# Altium project Receiver.PrjPcb (part 3 of 3)

## Sheet ADC.SchDoc: ADC
size A2; DrawnBy: Patrik Staudenmayer; DocumentNumber: 10; SheetNumber: 10; SheetTotal: 15
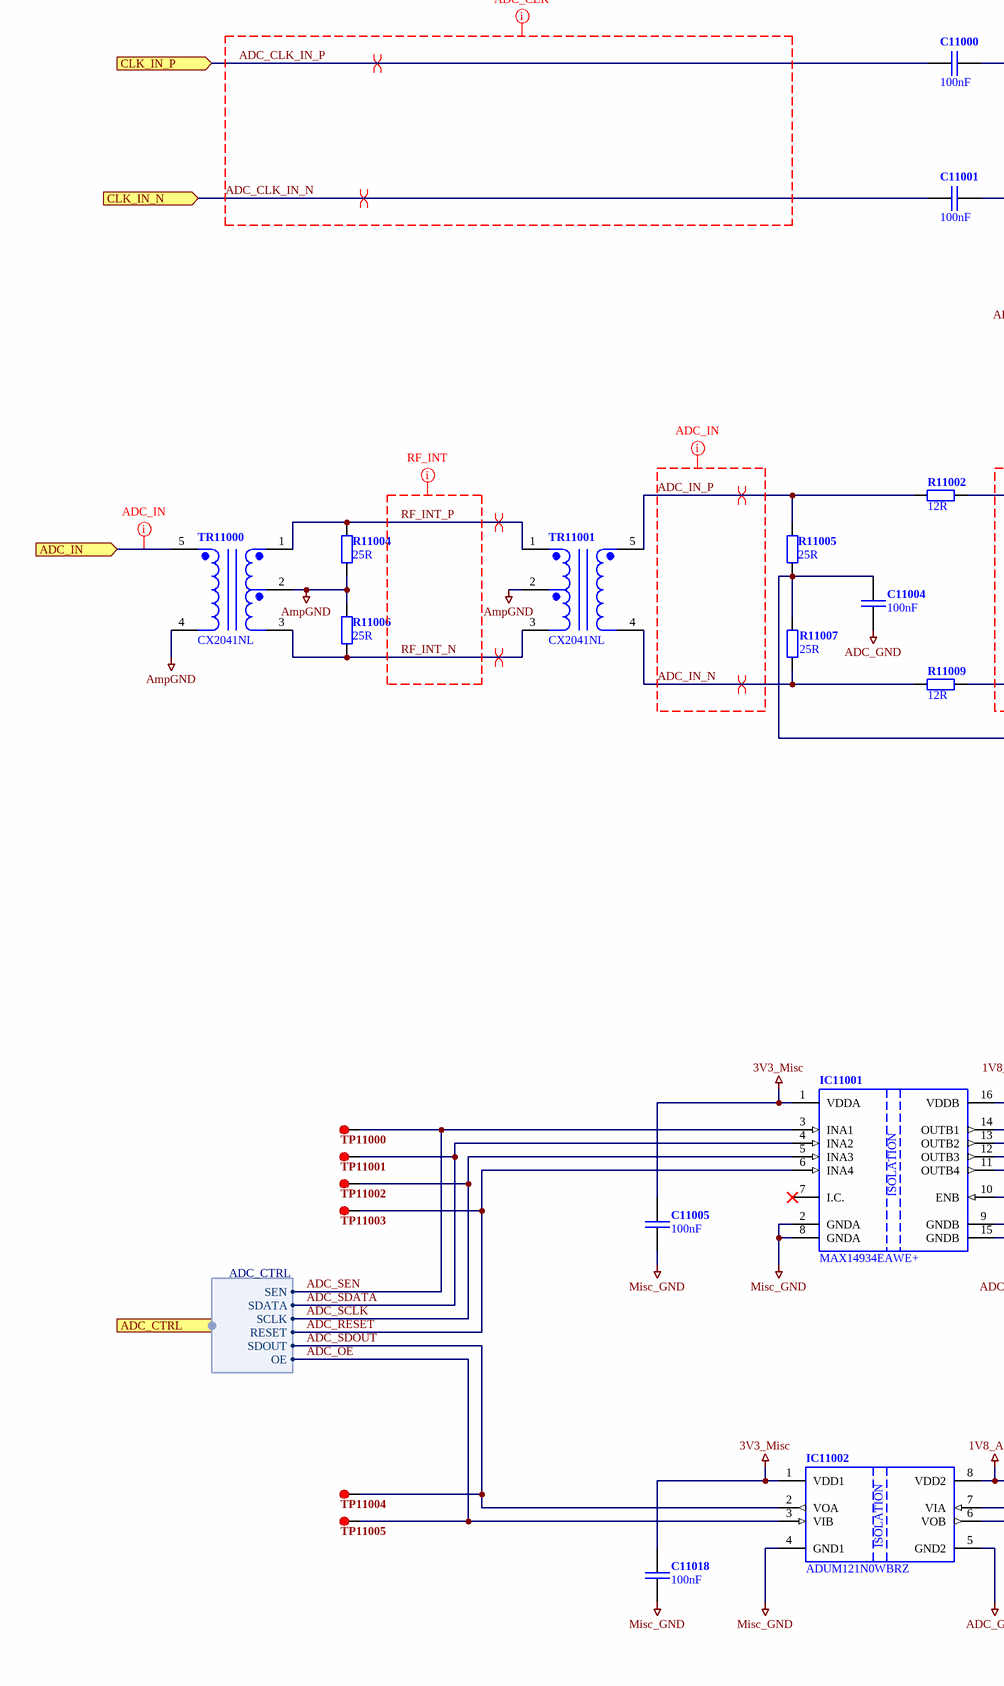
[diagram p14: ADC.SchDoc, left]
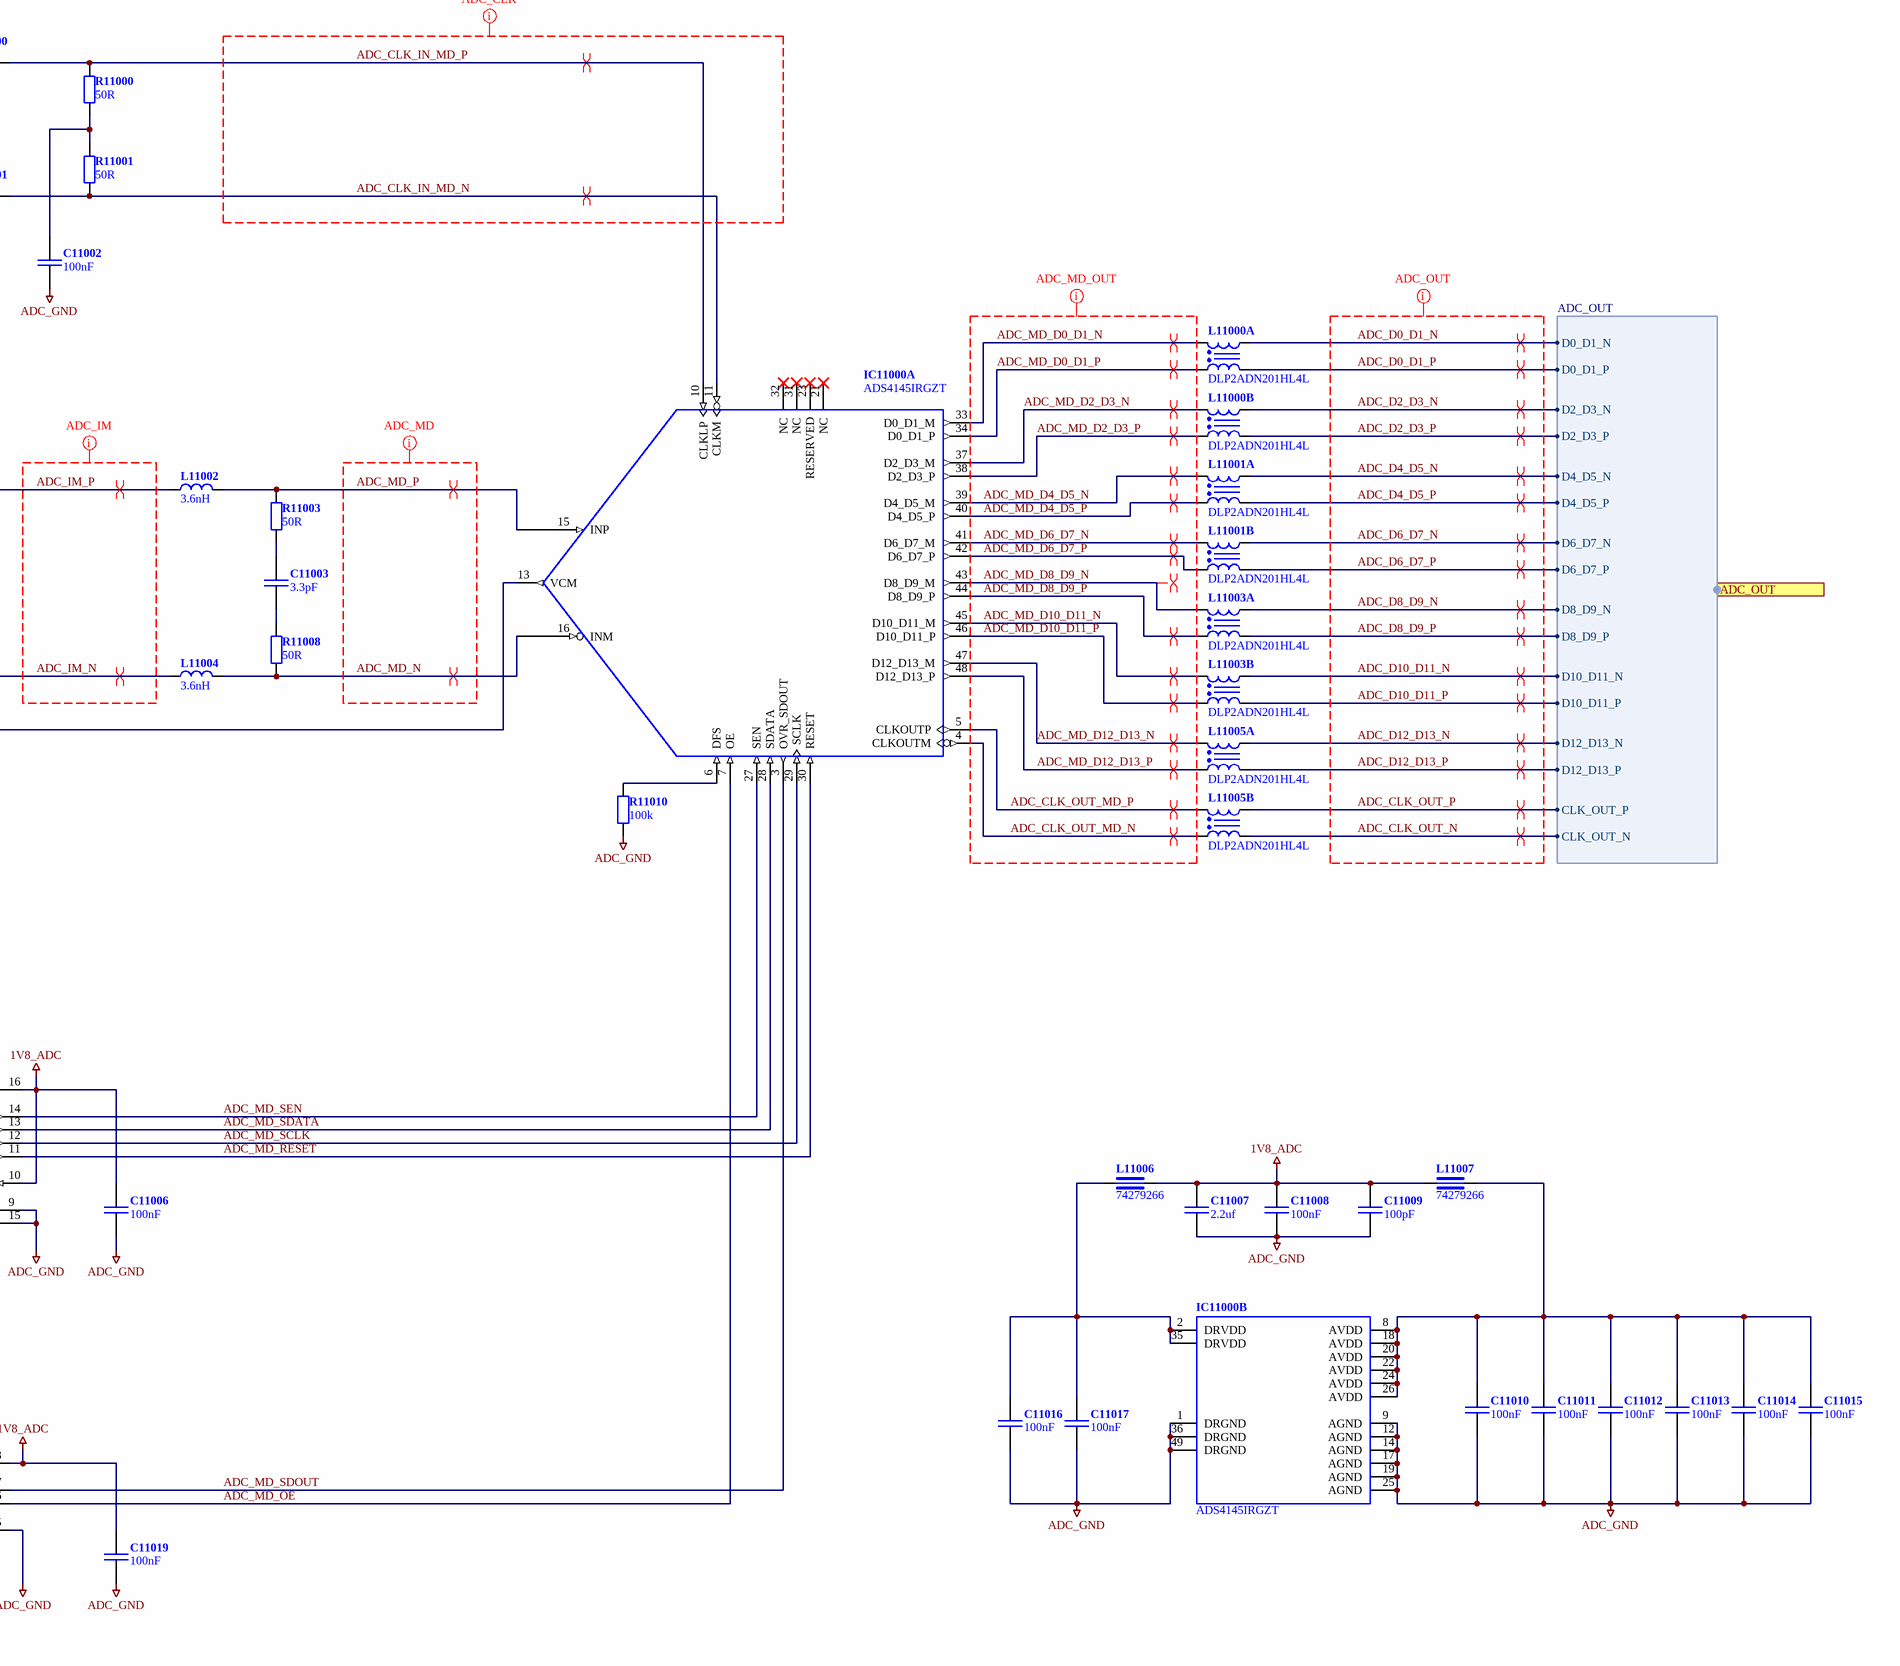
[diagram p15: ADC.SchDoc, right]

### Parts
C11000  100nF  [C_0603_N [CAPC1608N IPC]]
C11001  100nF  [C_0603_N [CAPC1608N IPC]]
C11002  100nF  [C_0603_N [CAPC1608N IPC]]
C11003  3.3pF  [C_0603_N [CAPC1608N IPC]]
C11004  100nF  [C_0603_N [CAPC1608N IPC]]
C11005  100nF  [C_0603_N [CAPC1608N IPC]]
C11006  100nF  [C_0603_N [CAPC1608N IPC]]
C11007  2.2uf  [C_1206_N [CAPC3216N IPC]]
C11008  100nF  [C_0805_N [CAPC2013N IPC]]
C11009  100pF  [C_0603_N [CAPC1608N IPC]]
C11010  100nF  [C_0603_N [CAPC1608N IPC]]
C11011  100nF  [C_0603_N [CAPC1608N IPC]]
C11012  100nF  [C_0603_N [CAPC1608N IPC]]
C11013  100nF  [C_0603_N [CAPC1608N IPC]]
C11014  100nF  [C_0603_N [CAPC1608N IPC]]
C11015  100nF  [C_0603_N [CAPC1608N IPC]]
C11016  100nF  [C_0603_N [CAPC1608N IPC]]
C11017  100nF  [C_0603_N [CAPC1608N IPC]]
C11018  100nF  [C_0603_N [CAPC1608N IPC]]
C11019  100nF  [C_0603_N [CAPC1608N IPC]]
IC11000  ADS4145IRGZT  [QFN50P700X700X100_HS-49N]  (parts A,B of 2)
IC11001  MAX14934EAWE+  [SOIC127P1030X265-16N IPC]
IC11002  ADUM121N0WBRZ  [SOIC127P600X175-8N IPC]
L11000  DLP2ADN201HL4L  [CAF-50P200X100-8N]  (parts A,B of 2)
L11001  DLP2ADN201HL4L  [CAF-50P200X100-8N]  (parts A,B of 2)
L11002  3.6nH  [L_0603_N [INDC1608N IPC]]
L11003  DLP2ADN201HL4L  [CAF-50P200X100-8N]  (parts A,B of 2)
L11004  3.6nH  [L_0603_N [INDC1608N IPC]]
L11005  DLP2ADN201HL4L  [CAF-50P200X100-8N]  (parts A,B of 2)
L11006  74279266  [L_0603_N [INDC1608N IPC]]
L11007  74279266  [L_0603_N [INDC1608N IPC]]
R11000  50R  [R_0603_N [RESC1608N IPC]]
R11001  50R  [R_0603_N [RESC1608N IPC]]
R11002  12R  [R_0603_N [RESC1608N IPC]]
R11003  50R  [R_0603_N [RESC1608N IPC]]
R11004  25R  [R_0603_N [RESC1608N IPC]]
R11005  25R  [R_0603_N [RESC1608N IPC]]
R11006  25R  [R_0603_N [RESC1608N IPC]]
R11007  25R  [R_0603_N [RESC1608N IPC]]
R11008  50R  [R_0603_N [RESC1608N IPC]]
R11009  12R  [R_0603_N [RESC1608N IPC]]
R11010  100k  [R_0603_N [RESC1608N IPC]]
TP11000  TP_GENERIC  [TP_0.8_P100T]  (value not drawn)  (no BOM)
TP11001  TP_GENERIC  [TP_0.8_P100T]  (value not drawn)  (no BOM)
TP11002  TP_GENERIC  [TP_0.8_P100T]  (value not drawn)  (no BOM)
TP11003  TP_GENERIC  [TP_0.8_P100T]  (value not drawn)  (no BOM)
TP11004  TP_GENERIC  [TP_0.8_P100T]  (value not drawn)  (no BOM)
TP11005  TP_GENERIC  [TP_0.8_P100T]  (value not drawn)  (no BOM)
TR11000  CX2041NL  [TR_CX2041NL]
TR11001  CX2041NL  [TR_CX2041NL]

### Ports
ADC_CTRL (out, harness ADC_CTRL), ADC_IN (in), ADC_OUT (out, harness ADC_OUT), CLK_IN_N (in), CLK_IN_P (in)

### Harnesses
ADC_CTRL: SEN, SDATA, SCLK, RESET, SDOUT, OE
ADC_OUT: D0_D1_N, D0_D1_P, D2_D3_N, D2_D3_P, D4_D5_N, D4_D5_P, D6_D7_N, D6_D7_P, D8_D9_N, D8_D9_P, D10_D11_N, D10_D11_P, D12_D13_N, D12_D13_P, CLK_OUT_P, CLK_OUT_N

### Nets
1V8_ADC: C11006.1 C11007.1 C11008.1 C11009.1 C11019.1 IC11001.10(ENB) IC11001.16(VDDB) IC11002.8(VDD2) L11006.2 L11007.2
3V3_Misc: C11005.2 C11018.2 IC11001.1(VDDA) IC11002.1(VDD1)
ADC_GND: C11002.2 C11004.2 C11006.2 C11007.2 C11008.2 C11009.2 C11010.2 C11011.2 C11012.2 C11013.2 C11014.2 C11015.2 C11016.2 C11017.2 C11019.2 IC11000.1(DRGND) IC11000.9(AGND) IC11000.12(AGND) IC11000.14(AGND) IC11000.17(AGND) IC11000.19(AGND) IC11000.25(AGND) IC11000.36(DRGND) IC11000.49(DRGND) IC11001.9(GNDB) IC11001.15(GNDB) IC11002.5(GND2) R11010.1
AmpGND: R11004.1 R11006.2 TR11000.2 TR11000.4 TR11001.2
Misc_GND: C11005.1 C11018.1 IC11001.2(GNDA) IC11001.8(GNDA) IC11002.4(GND1)  [project net Con_GND]
ADC_CLK_IN_MD_N: C11001.1 IC11000.11(CLKM) R11001.1
ADC_CLK_IN_MD_P: C11000.1 IC11000.10(CLKLP) R11000.2
ADC_CLK_IN_N: C11001.2 ; port CLK_IN_N
ADC_CLK_IN_P: C11000.2 ; port CLK_IN_P
ADC_CLK_OUT_MD_N: IC11000.4(CLKOUTM) L11005.3
ADC_CLK_OUT_MD_P: IC11000.5(CLKOUTP) L11005.4
ADC_CLK_OUT_N: L11005.6 ; port ADC_OUT.CLK_OUT_N
ADC_CLK_OUT_P: L11005.5 ; port ADC_OUT.CLK_OUT_P
ADC_D0_D1_N: L11000.7 ; port ADC_OUT.D0_D1_N
ADC_D0_D1_P: L11000.8 ; port ADC_OUT.D0_D1_P
ADC_D2_D3_N: L11000.5 ; port ADC_OUT.D2_D3_N
ADC_D2_D3_P: L11000.6 ; port ADC_OUT.D2_D3_P
ADC_D4_D5_N: L11001.7 ; port ADC_OUT.D4_D5_N
ADC_D4_D5_P: L11001.8 ; port ADC_OUT.D4_D5_P
ADC_D6_D7_N: L11001.5 ; port ADC_OUT.D6_D7_N
ADC_D6_D7_P: L11001.6 ; port ADC_OUT.D6_D7_P
ADC_D8_D9_N: L11003.7 ; port ADC_OUT.D8_D9_N
ADC_D8_D9_P: L11003.8 ; port ADC_OUT.D8_D9_P
ADC_D10_D11_N: L11003.5 ; port ADC_OUT.D10_D11_N
ADC_D10_D11_P: L11003.6 ; port ADC_OUT.D10_D11_P
ADC_D12_D13_N: L11005.7 ; port ADC_OUT.D12_D13_N
ADC_D12_D13_P: L11005.8 ; port ADC_OUT.D12_D13_P
ADC_IM_N: L11004.1 R11009.1
ADC_IM_P: L11002.1 R11002.1
ADC_IN_N: R11007.1 R11009.2 TR11001.4
ADC_IN_P: R11002.2 R11005.2 TR11001.5
ADC_MD_D0_D1_N: IC11000.33(D0_D1_M) L11000.2
ADC_MD_D0_D1_P: IC11000.34(D0_D1_P) L11000.1
ADC_MD_D2_D3_N: IC11000.37(D2_D3_M) L11000.4
ADC_MD_D2_D3_P: IC11000.38(D2_D3_P) L11000.3
ADC_MD_D4_D5_N: IC11000.39(D4_D5_M) L11001.2
ADC_MD_D4_D5_P: IC11000.40(D4_D5_P) L11001.1
ADC_MD_D6_D7_N: IC11000.41(D6_D7_M) L11001.4
ADC_MD_D6_D7_P: IC11000.42(D6_D7_P) L11001.3
ADC_MD_D8_D9_N: IC11000.43(D8_D9_M) L11003.2
ADC_MD_D8_D9_P: IC11000.44(D8_D9_P) L11003.1
ADC_MD_D10_D11_N: IC11000.45(D10_D11_M) L11003.4
ADC_MD_D10_D11_P: IC11000.46(D10_D11_P) L11003.3
ADC_MD_D12_D13_N: IC11000.47(D12_D13_M) L11005.2
ADC_MD_D12_D13_P: IC11000.48(D12_D13_P) L11005.1
ADC_MD_N: IC11000.16(INM) L11004.2 R11008.1
ADC_MD_OE: IC11000.7(OE) IC11002.6(VOB)
ADC_MD_P: IC11000.15(INP) L11002.2 R11003.2
ADC_MD_RESET: IC11000.30(RESET) IC11001.11(OUTB4)
ADC_MD_SCLK: IC11000.29(SCLK) IC11001.12(OUTB3)
ADC_MD_SDATA: IC11000.28(SDATA) IC11001.13(OUTB2)
ADC_MD_SDOUT: IC11000.3(OVR_SDOUT) IC11002.7(VIA)
ADC_MD_SEN: IC11000.27(SEN) IC11001.14(OUTB1)
ADC_OE: IC11002.3(VIB) TP11005.1 ; port ADC_CTRL.OE
ADC_RESET: IC11001.6(INA4) TP11003.1 ; port ADC_CTRL.RESET
ADC_SCLK: IC11001.5(INA3) TP11002.1 ; port ADC_CTRL.SCLK
ADC_SDATA: IC11001.4(INA2) TP11001.1 ; port ADC_CTRL.SDATA
ADC_SDOUT: IC11002.2(VOA) TP11004.1 ; port ADC_CTRL.SDOUT
ADC_SEN: IC11001.3(INA1) TP11000.1 ; port ADC_CTRL.SEN
RF_INT_N: R11006.1 TR11000.3 TR11001.3
RF_INT_P: R11004.2 TR11000.1 TR11001.1
NetC11002_1: C11002.1 R11000.1 R11001.2
NetC11003_1: C11003.1 R11003.1
NetC11003_2: C11003.2 R11008.2
NetC11004_1: C11004.1 IC11000.13(VCM) R11005.1 R11007.2
NetC11010_1: C11010.1 C11011.1 C11012.1 C11013.1 C11014.1 C11015.1 IC11000.8(AVDD) IC11000.18(AVDD) IC11000.20(AVDD) IC11000.22(AVDD) IC11000.24(AVDD) IC11000.26(AVDD) L11007.1
NetC11016_1: C11016.1 C11017.1 IC11000.2(DRVDD) IC11000.35(DRVDD) L11006.1
NetIC11000_6: IC11000.6(DFS) R11010.2
NetTR11000_5: TR11000.5 ; port ADC_IN

Not connected (* = marked no-connect by the designer): IC11000 21(NC)* 23(RESERVED)* 31(NC)* 32(NC)*; IC11001 7(I.C.)*

### Layout directives
differential pair: ADC_CLK_IN_MD_N, ADC_CLK_IN_MD_P, ADC_CLK_IN_N, ADC_CLK_IN_P, ADC_CLK_OUT_MD_N, ADC_CLK_OUT_MD_P, ADC_CLK_OUT_N, ADC_CLK_OUT_P, ADC_D0_D1_N, ADC_D0_D1_P, ADC_D2_D3_N, ADC_D2_D3_P, ADC_D4_D5_N, ADC_D4_D5_P, ADC_D6_D7_N, ADC_D6_D7_P, ADC_D8_D9_N, ADC_D8_D9_P, ADC_D10_D11_N, ADC_D10_D11_P, ADC_D12_D13_N, ADC_D12_D13_P, ADC_IM_N, ADC_IM_P, ADC_IN_N, ADC_IN_P, ADC_MD_D0_D1_N, ADC_MD_D0_D1_P, ADC_MD_D2_D3_N, ADC_MD_D2_D3_P, ADC_MD_D4_D5_N, ADC_MD_D4_D5_P, ADC_MD_D6_D7_N, ADC_MD_D6_D7_P, ADC_MD_D8_D9_N, ADC_MD_D8_D9_P, ADC_MD_D10_D11_N, ADC_MD_D10_D11_P, ADC_MD_D12_D13_N, ADC_MD_D12_D13_P, ADC_MD_N, ADC_MD_P, RF_INT_N, RF_INT_P
net class ADC_IN; rule Differential Pairs Routing [Pref Gap = 5mil    Min Gap  = 5mil    Max Gap  = 5milPref Width = 16.899mil    Min Width  = 14.432mil    Max Width  = 16.899mil]: ADC_IN_N, ADC_IN_P
net class ADC_IM; rule Differential Pairs Routing [Pref Gap = 5mil    Min Gap  = 5mil    Max Gap  = 5milPref Width = 16.899mil    Min Width  = 14.432mil    Max Width  = 16.899mil]: ADC_IM_N, ADC_IM_P
net class ADC_MD; rule Differential Pairs Routing [Pref Gap = 5mil    Min Gap  = 5mil    Max Gap  = 5milPref Width = 16.899mil    Min Width  = 14.432mil    Max Width  = 16.899mil]: ADC_MD_N, ADC_MD_P
net class AD_IM; rule Differential Pairs Routing [Pref Gap = 5mil    Min Gap  = 5mil    Max Gap  = 5milPref Width = 4.138mil    Min Width  = 2.925mil    Max Width  = 4.138mil]; rule Maximum Via Count Constraint [Max Count = 2]; rule Matched Net Lengths [Tolerance = 25mil]: ADC_CLK_IN_N, ADC_CLK_IN_P
rule Maximum Via Count Constraint [Max Count = 2]; rule Differential Pairs Routing [Pref Gap = 5mil    Min Gap  = 5mil    Max Gap  = 5milPref Width = 4.138mil    Min Width  = 2.925mil    Max Width  = 4.138mil]; rule Matched Net Lengths [Tolerance = 25mil]; net class ADC_MD_OUT: ADC_CLK_OUT_MD_N, ADC_CLK_OUT_MD_P, ADC_MD_D0_D1_N, ADC_MD_D0_D1_P, ADC_MD_D2_D3_N, ADC_MD_D2_D3_P, ADC_MD_D4_D5_N, ADC_MD_D4_D5_P, ADC_MD_D6_D7_N, ADC_MD_D6_D7_P, ADC_MD_D8_D9_N, ADC_MD_D8_D9_P, ADC_MD_D10_D11_N, ADC_MD_D10_D11_P, ADC_MD_D12_D13_N, ADC_MD_D12_D13_P
rule Maximum Via Count Constraint [Max Count = 2]; rule Differential Pairs Routing [Pref Gap = 5mil    Min Gap  = 5mil    Max Gap  = 5milPref Width = 4.138mil    Min Width  = 2.925mil    Max Width  = 4.138mil]; rule Matched Net Lengths [Tolerance = 25mil]; net class ADC_OUT: ADC_CLK_OUT_N, ADC_CLK_OUT_P, ADC_D0_D1_N, ADC_D0_D1_P, ADC_D2_D3_N, ADC_D2_D3_P, ADC_D4_D5_N, ADC_D4_D5_P, ADC_D6_D7_N, ADC_D6_D7_P, ADC_D8_D9_N, ADC_D8_D9_P, ADC_D10_D11_N, ADC_D10_D11_P, ADC_D12_D13_N, ADC_D12_D13_P
rule Differential Pairs Routing [Pref Gap = 5mil    Min Gap  = 5mil    Max Gap  = 5milPref Width = 16.899mil    Min Width  = 14.432mil    Max Width  = 16.899mil]; rule Maximum Via Count Constraint [Max Count = 2]; rule Matched Net Lengths [Tolerance = 25mil]; net class RF_INT: RF_INT_N, RF_INT_P
rule Width Constraint [Pref Impedance = 50.00ohms    Min Impedance = 50.00ohms    Max Impedance = 50.00ohms]: NetTR11000_5
net class ADC_MD; rule Differential Pairs Routing [Pref Gap = 5mil    Min Gap  = 5mil    Max Gap  = 5milPref Width = 4.138mil    Min Width  = 2.925mil    Max Width  = 4.138mil]; rule Maximum Via Count Constraint [Max Count = 2]; rule Matched Net Lengths [Tolerance = 25mil]: ADC_CLK_IN_MD_N, ADC_CLK_IN_MD_P

### Notes on the sheet
- Project:
- Title:
- Size:
- Date:
- File:
- A2
- Project ID:
- Time:
- Sheet
- Version:
- of
- Variant:
- (in symbol IC_ADUM121N0WBRZ) ISOLATION
- (in symbol IC_MAX14934EAWE+) ISOLATION

### Library data of the parts
C11000-C11002 = C_GENERIC: Prometheus_Manufacturer: Yageo; Prometheus_ID: CC0603JRX7R7BB104; Prometheus_ManPartNo: 100nF; Prometheus_Comment: 100nF; Prometheus_CurrentFootprint: C_0603_N [CAPC1608N IPC]
C11003-C11019 = C_GENERIC: Prometheus_ID: *; Prometheus_Manufacturer: *
  C11003: Prometheus_ManPartNo: 3.3pF; Prometheus_Comment: 3.3pF; Prometheus_CurrentFootprint: C_0603_N [CAPC1608N IPC]
  C11004-C11006 C11010-C11019: Prometheus_ManPartNo: 100nF; Prometheus_Comment: 100nF; Prometheus_CurrentFootprint: C_0603_N [CAPC1608N IPC]
  C11007: Prometheus_ManPartNo: 2.2uf; Prometheus_Comment: 2.2uf; Prometheus_CurrentFootprint: C_1206_N [CAPC3216N IPC]
  C11008: Prometheus_ManPartNo: 100nF; Prometheus_Comment: 100nF; Prometheus_CurrentFootprint: C_0805_N [CAPC2013N IPC]
  C11009: Prometheus_ManPartNo: 100pF; Prometheus_Comment: 100pF; Prometheus_CurrentFootprint: C_0603_N [CAPC1608N IPC]
IC11000 = IC_ADS4145IRGZT: 12 Bit, 125 MSPS Ultra-Low-Power ADC / Dynamical Power Scaling with sample rate / Output Interface: / DDR LVDS / Parallel CMOS / 1.8 V Single supply; Prometheus_Manufacturer: Texas Instruments; Prometheus_ManPartNo: ADS4145IRGZT; Prometheus_Comment: ADS4145IRGZT; Prometheus_CurrentFootprint: QFN50P700X700X100_HS-49N; DatasheetURL: https://www.ti.com/lit/ds/symlink/ads4145.pdf
IC11001 = IC_MAX14934EAWE+: High-Speed, Robust-EMC Reinforced Six-Channel Digital Isolators / 100 Mbps data rate / Vcc: 2.25 V ... 5.5 V / 2.25 V to 5.5 V level translation; Prometheus_Manufacturer: Maxim Integrated; Prometheus_ManPartNo: MAX14934EAWE+; Prometheus_Comment: MAX14934EAWE+; Prometheus_CurrentFootprint: SOIC127P1030X265-16N IPC; DatasheetURL: https://datasheets.maximintegrated.com/en/ds/MAX14934-MAX14936.pdf
IC11002 = IC_ADUM121N0WBRZ: 1/1 digital isolator / 1.8 V to 5 V Level translation; Prometheus_Manufacturer: Analog Devices; Prometheus_ManPartNo: ADUM121N0WBRZ; Prometheus_Comment: ADUM121N0WBRZ; Prometheus_CurrentFootprint: SOIC127P600X175-8N IPC; DatasheetURL: https://www.analog.com/media/en/technical-documentation/data-sheets/ADuM120N_121N.pdf
L11000 L11001 L11003 L11005 = L_COMMONMODE_CHOKE_DLP2ADN201HL4L: Prometheus_Manufacturer: Murata Electronics; Prometheus_ID: *; Prometheus_ManPartNo: DLP2ADN201HL4L; Prometheus_Comment: DLP2ADN201HL4L; Prometheus_CurrentFootprint: CAF-50P200X100-8N
L11002 L11004 = L_GENERIC: Prometheus_ManPartNo: 744917036; Prometheus_Manufacturer: Wuerth Electronics; Prometheus_ID: *; Prometheus_Comment: 3.6nH; Prometheus_CurrentFootprint: L_0603_N [INDC1608N IPC]
L11006 L11007 = FB_GENERIC: 1 kOHM @ 100 MHz / 200 mA max.; Prometheus_ID: *; Prometheus_ManPartNo: 74279266; Prometheus_Manufacturer: *; Prometheus_Comment: 74279266; Prometheus_CurrentFootprint: L_0603_N [INDC1608N IPC]
R11000-R11010 = R_GENERIC_DIN: Prometheus_ID: *; Prometheus_Manufacturer: *; Prometheus_CurrentFootprint: R_0603_N [RESC1608N IPC]
  R11000 R11001 R11003 R11008: Prometheus_ManPartNo: 50R; Prometheus_Comment: 50R
  R11002 R11009: Prometheus_ManPartNo: 12R; Prometheus_Comment: 12R
  R11004-R11007: Prometheus_ManPartNo: 25R; Prometheus_Comment: 25R
  R11010: Prometheus_ManPartNo: 100k; Prometheus_Comment: 100k
TP11000-TP11005 = TP_GENERIC: Needle Test Point; Prometheus_ID: *; Prometheus_ManPartNo: TP_GENERIC; Prometheus_Manufacturer: *; Prometheus_Comment: TP_GENERIC; Prometheus_CurrentFootprint: TP_0.8_P100T
TR11000 TR11001 = TR_CX2041NL: Balun / 1:1 with center tap / 3 dB Bandwidth: 0.05 MHz to 450 MHz; Prometheus_Manufacturer: Pulse Engineering; Prometheus_ID: *; Prometheus_ManPartNo: CX2041NL; Prometheus_Comment: CX2041NL; Prometheus_CurrentFootprint: TR_CX2041NL

## Sheet ClockGenerator.SchDoc: Clock Generator
size A2; DrawnBy: Patrik Staudenmayer; DocumentNumber: 11; SheetNumber: 11; SheetTotal: 15
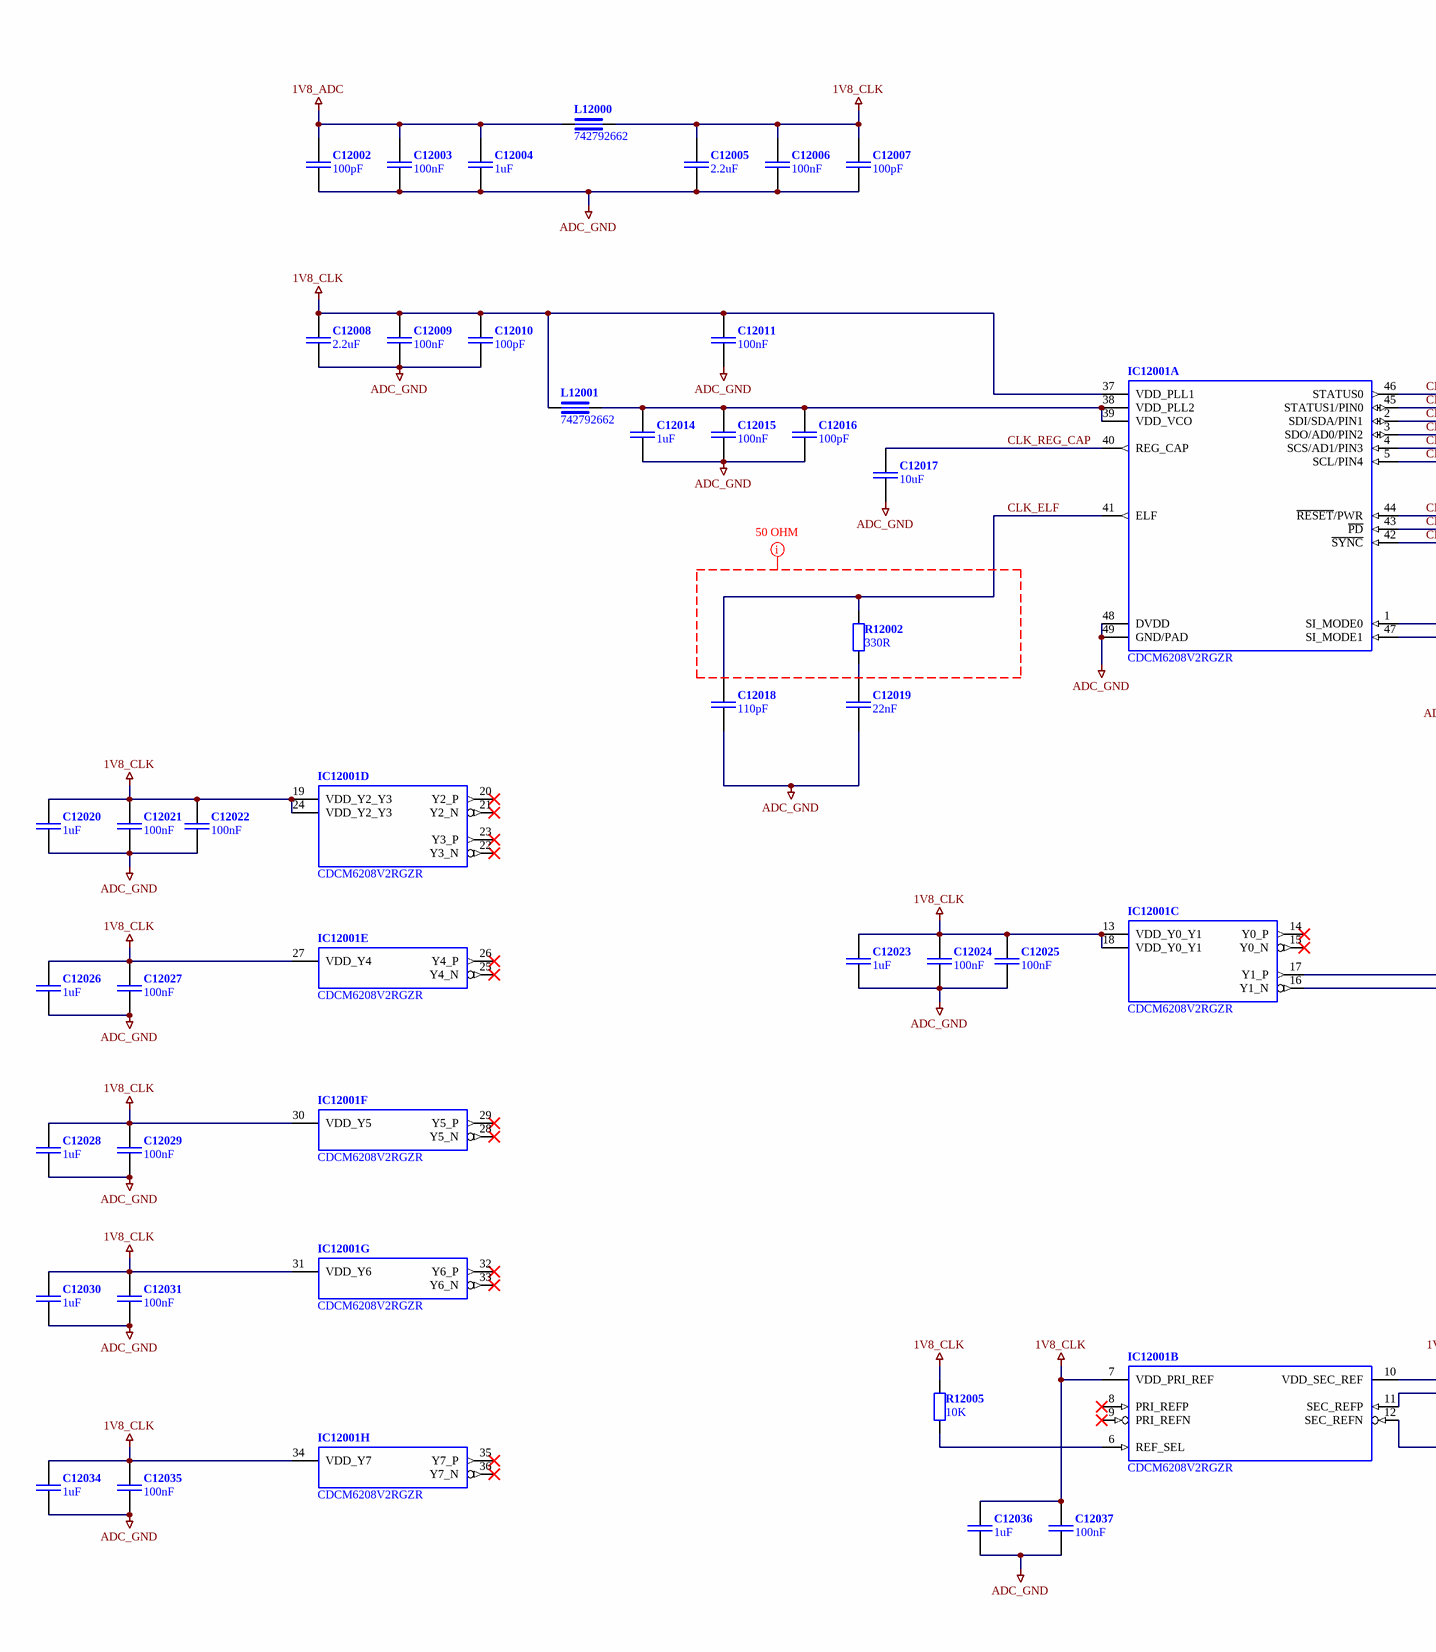
[diagram p16: ClockGenerator.SchDoc, left]
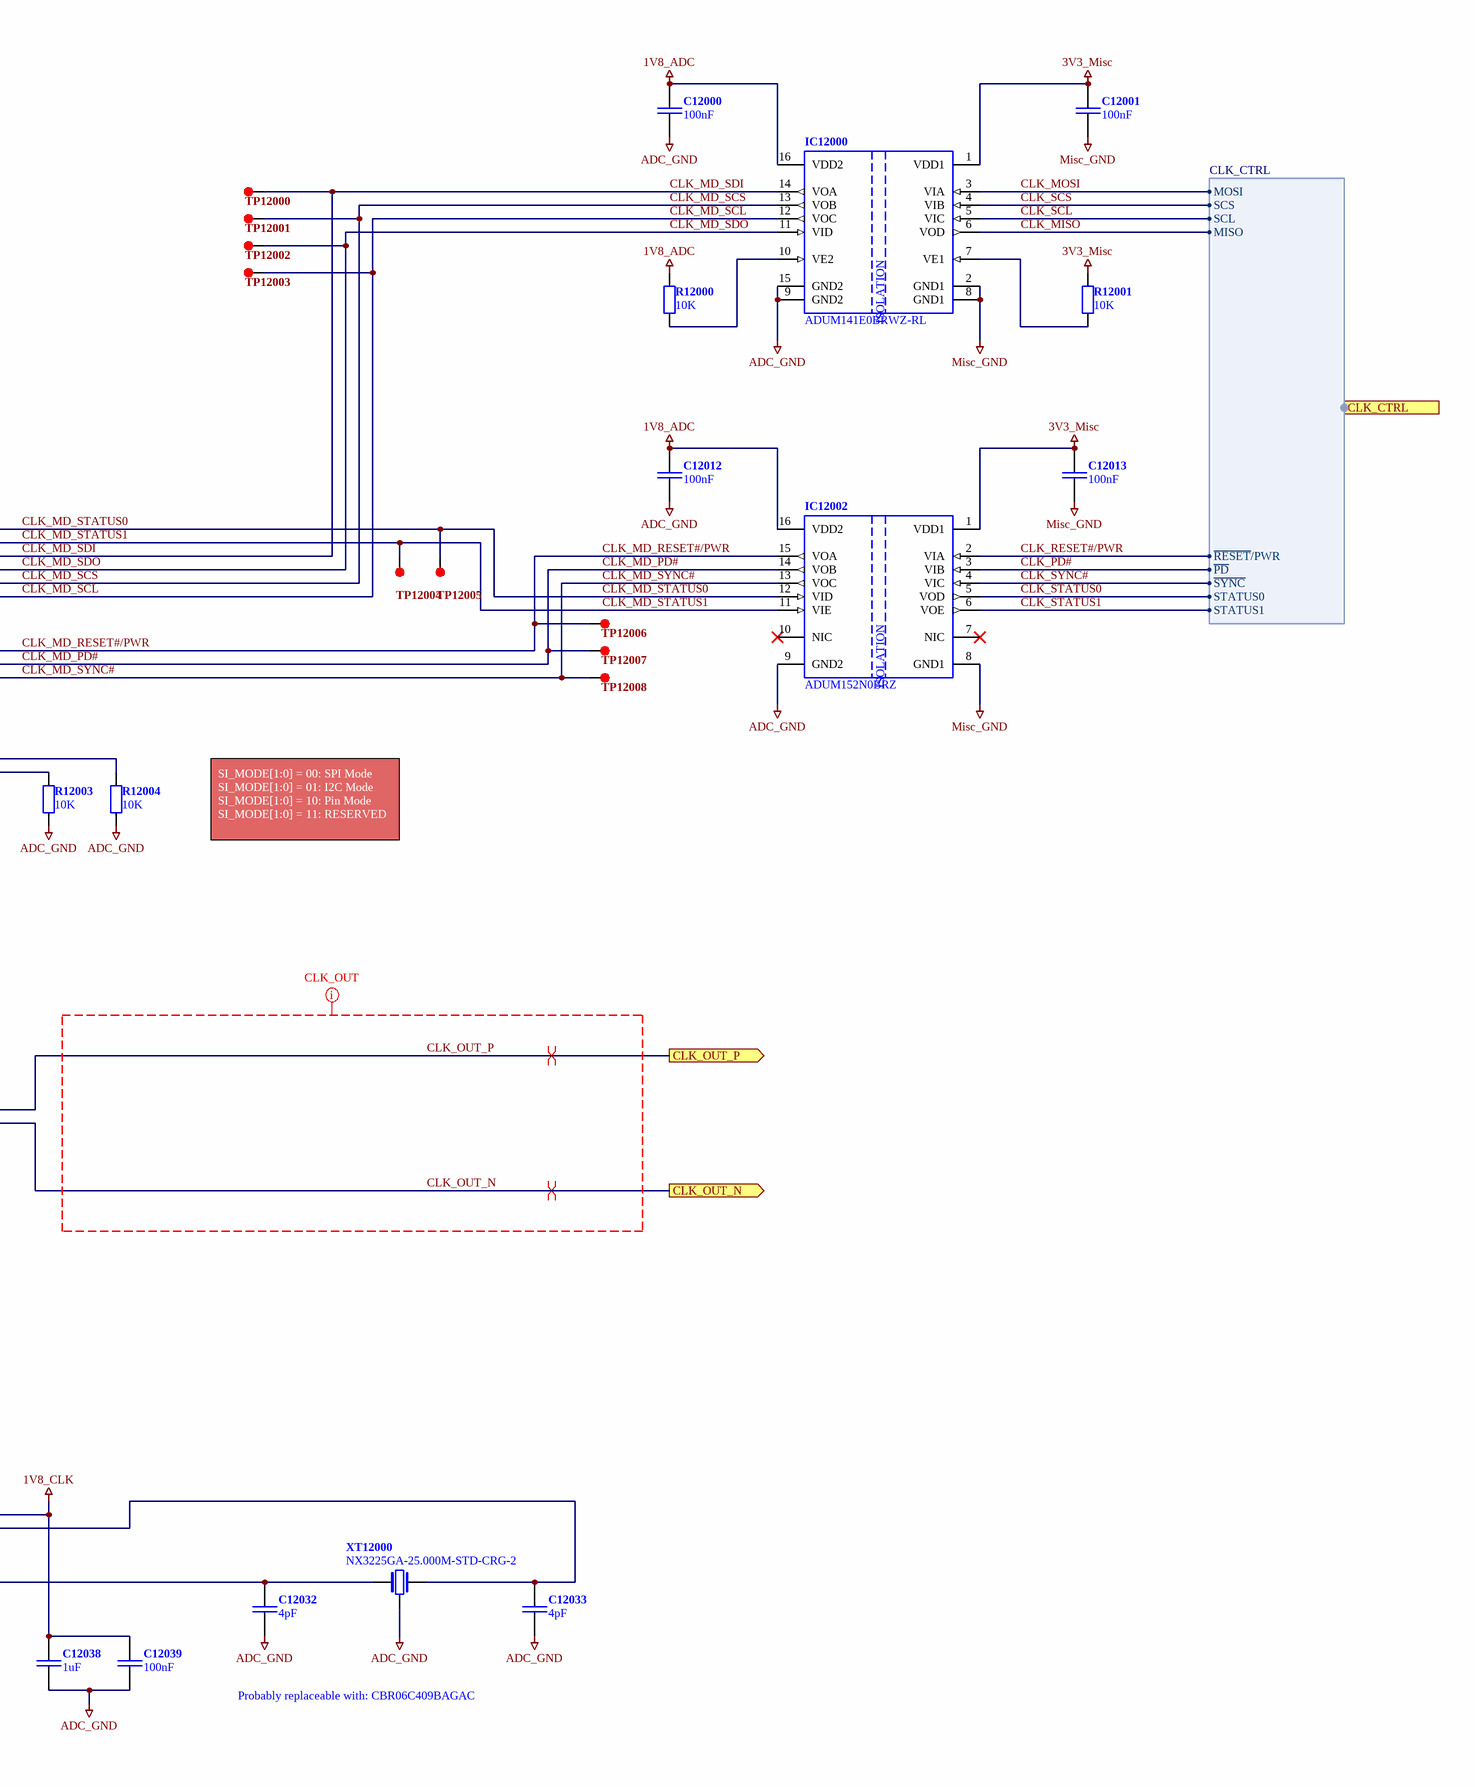
[diagram p17: ClockGenerator.SchDoc, right]

### Parts
C12000  100nF  [C_0603_N [CAPC1608N IPC]]
C12001  100nF  [C_0603_N [CAPC1608N IPC]]
C12002  100pF  [C_0402_N [CAPC1005N IPC]]
C12003  100nF  [C_0603_N [CAPC1608N IPC]]
C12004  1uF  [C_0805_N [CAPC2013N IPC]]
C12005  2.2uF  [C_0805_N [CAPC2013N IPC]]
C12006  100nF  [C_0603_N [CAPC1608N IPC]]
C12007  100pF  [C_0402_N [CAPC1005N IPC]]
C12008  2.2uF  [C_0805_N [CAPC2013N IPC]]
C12009  100nF  [C_0603_N [CAPC1608N IPC]]
C12010  100pF  [C_0402_N [CAPC1005N IPC]]
C12011  100nF  [C_0603_N [CAPC1608N IPC]]
C12012  100nF  [C_0603_N [CAPC1608N IPC]]
C12013  100nF  [C_0603_N [CAPC1608N IPC]]
C12014  1uF  [C_0805_N [CAPC2013N IPC]]
C12015  100nF  [C_0603_N [CAPC1608N IPC]]
C12016  100pF  [C_0402_N [CAPC1005N IPC]]
C12017  10uF  [C_0805_N [CAPC2013N IPC]]
C12018  110pF  [C_0603_N [CAPC1608N IPC]]
C12019  22nF  [C_0603_N [CAPC1608N IPC]]
C12020  1uF  [C_0805_N [CAPC2013N IPC]]
C12021  100nF  [C_0603_N [CAPC1608N IPC]]
C12022  100nF  [C_0603_N [CAPC1608N IPC]]
C12023  1uF  [C_0805_N [CAPC2013N IPC]]
C12024  100nF  [C_0603_N [CAPC1608N IPC]]
C12025  100nF  [C_0603_N [CAPC1608N IPC]]
C12026  1uF  [C_0805_N [CAPC2013N IPC]]
C12027  100nF  [C_0603_N [CAPC1608N IPC]]
C12028  1uF  [C_0805_N [CAPC2013N IPC]]
C12029  100nF  [C_0603_N [CAPC1608N IPC]]
C12030  1uF  [C_0805_N [CAPC2013N IPC]]
C12031  100nF  [C_0603_N [CAPC1608N IPC]]
C12032  4pF  [C_0603_N [CAPC1608N IPC]]
C12033  4pF  [C_0603_N [CAPC1608N IPC]]
C12034  1uF  [C_0805_N [CAPC2013N IPC]]
C12035  100nF  [C_0603_N [CAPC1608N IPC]]
C12036  1uF  [C_0805_N [CAPC2013N IPC]]
C12037  100nF  [C_0603_N [CAPC1608N IPC]]
C12038  1uF  [C_0805_N [CAPC2013N IPC]]
C12039  100nF  [C_0603_N [CAPC1608N IPC]]
IC12000  ADUM141E0BRWZ-RL  [SOIC127P1030X265-16N IPC]
IC12001  CDCM6208V2RGZR  [QFN50P700X700X100_HS-49N IPC]  (parts A,B,C,D,E,F,G,H of 8)
IC12002  ADUM152N0BRZ  [SOIC127P600X175-16N IPC]
L12000  742792662  [L_0603_N [INDC1608N IPC]]
L12001  742792662  [L_0603_N [INDC1608N IPC]]
R12000  10K  [R_0603_N [RESC1608N IPC]]
R12001  10K  [R_0603_N [RESC1608N IPC]]
R12002  330R  [R_0603_N [RESC1608N IPC]]
R12003  10K  [R_0603_N [RESC1608N IPC]]
R12004  10K  [R_0603_N [RESC1608N IPC]]
R12005  10K  [R_0603_N [RESC1608N IPC]]
TP12000  TP_GENERIC  [TP_0.8_P100T]  (value not drawn)  (no BOM)
TP12001  TP_GENERIC  [TP_0.8_P100T]  (value not drawn)  (no BOM)
TP12002  TP_GENERIC  [TP_0.8_P100T]  (value not drawn)  (no BOM)
TP12003  TP_GENERIC  [TP_0.8_P100T]  (value not drawn)  (no BOM)
TP12004  TP_GENERIC  [TP_0.8_P100T]  (value not drawn)  (no BOM)
TP12005  TP_GENERIC  [TP_0.8_P100T]  (value not drawn)  (no BOM)
TP12006  TP_GENERIC  [TP_0.8_P100T]  (value not drawn)  (no BOM)
TP12007  TP_GENERIC  [TP_0.8_P100T]  (value not drawn)  (no BOM)
TP12008  TP_GENERIC  [TP_0.8_P100T]  (value not drawn)  (no BOM)
XT12000  NX3225GA-25.000M-STD-CRG-2  [XT_SMD_320x250_H100_4PIN]

### Ports
CLK_CTRL (harness CLK_CTRL), CLK_OUT_N (out), CLK_OUT_P (out)

### Harnesses
CLK_CTRL: MOSI, SCS, SCL, MISO, ~{RESET}/PWR, ~{PD}, ~{SYNC}, STATUS0, STATUS1

### Nets
1V8_ADC: C12000.1 C12002.1 C12003.1 C12004.1 C12012.1 IC12000.16(VDD2) IC12002.16(VDD2) L12000.2 R12000.2
1V8_CLK: C12005.1 C12006.1 C12007.1 C12008.1 C12009.1 C12010.1 C12011.1 C12020.1 C12021.1 C12022.1 C12023.1 C12024.1 C12025.1 C12026.1 C12027.1 C12028.1 C12029.1 C12030.1 C12031.1 C12034.1 C12035.1 C12036.1 C12037.1 C12038.1 C12039.1 IC12001.7(VDD_PRI_REF) IC12001.10(VDD_SEC_REF) IC12001.13(VDD_Y0_Y1) IC12001.18(VDD_Y0_Y1) IC12001.19(VDD_Y2_Y3) IC12001.24(VDD_Y2_Y3) IC12001.27(VDD_Y4) IC12001.30(VDD_Y5) IC12001.31(VDD_Y6) IC12001.34(VDD_Y7) IC12001.37(VDD_PLL1) L12000.1 L12001.2 R12005.2
3V3_Misc: C12001.1 C12013.1 IC12000.1(VDD1) IC12002.1(VDD1) R12001.2
ADC_GND: C12000.2 C12002.2 C12003.2 C12004.2 C12005.2 C12006.2 C12007.2 C12008.2 C12009.2 C12010.2 C12011.2 C12012.2 C12014.2 C12015.2 C12016.2 C12017.2 C12018.1 C12019.1 C12020.2 C12021.2 C12022.2 C12023.2 C12024.2 C12025.2 C12026.2 C12027.2 C12028.2 C12029.2 C12030.2 C12031.2 C12032.2 C12033.2 C12034.2 C12035.2 C12036.2 C12037.2 C12038.2 C12039.2 IC12000.9(GND2) IC12000.15(GND2) IC12001.48(DVDD) IC12001.49(GND/PAD) IC12002.9(GND2) R12003.1 R12004.1 XT12000.SH
Misc_GND: C12001.2 C12013.2 IC12000.2(GND1) IC12000.8(GND1) IC12002.8(GND1)  [project net Con_GND]
CLK_ELF: C12018.2 IC12001.41(ELF) R12002.2
CLK_MD_PD#: IC12001.43(~{PD}) IC12002.14(VOB) TP12007.1
CLK_MD_RESET#/PWR: IC12001.44(~{RESET}/PWR) IC12002.15(VOA) TP12006.1
CLK_MD_SCL: IC12000.12(VOC) IC12001.5(SCL/PIN4) TP12003.1
CLK_MD_SCS: IC12000.13(VOB) IC12001.4(SCS/AD1/PIN3) TP12001.1
CLK_MD_SDI: IC12000.14(VOA) IC12001.2(SDI/SDA/PIN1) TP12000.1
CLK_MD_SDO: IC12000.11(VID) IC12001.3(SDO/AD0/PIN2) TP12002.1
CLK_MD_STATUS0: IC12001.46(STATUS0) IC12002.12(VID) TP12005.1
CLK_MD_STATUS1: IC12001.45(STATUS1/PIN0) IC12002.11(VIE) TP12004.1
CLK_MD_SYNC#: IC12001.42(~{SYNC}) IC12002.13(VOC) TP12008.1
CLK_MISO: IC12000.6(VOD) ; port CLK_CTRL.MISO
CLK_MOSI: IC12000.3(VIA) ; port CLK_CTRL.MOSI
CLK_OUT_N: IC12001.16(Y1_N) ; port CLK_OUT_N
CLK_OUT_P: IC12001.17(Y1_P) ; port CLK_OUT_P
CLK_PD#: IC12002.3(VIB) ; port CLK_CTRL.~{PD}
CLK_REG_CAP: C12017.1 IC12001.40(REG_CAP)
CLK_RESET#/PWR: IC12002.2(VIA) ; port CLK_CTRL.~{RESET}/PWR
CLK_SCL: IC12000.5(VIC) ; port CLK_CTRL.SCL
CLK_SCS: IC12000.4(VIB) ; port CLK_CTRL.SCS
CLK_STATUS0: IC12002.5(VOD) ; port CLK_CTRL.STATUS0
CLK_STATUS1: IC12002.6(VOE) ; port CLK_CTRL.STATUS1
CLK_SYNC#: IC12002.4(VIC) ; port CLK_CTRL.~{SYNC}
NetC12014_1: C12014.1 C12015.1 C12016.1 IC12001.38(VDD_PLL2) IC12001.39(VDD_VCO) L12001.1
NetC12019_2: C12019.2 R12002.1
NetC12032_1: C12032.1 IC12001.12(SEC_REFN) XT12000.3
NetC12033_1: C12033.1 IC12001.11(SEC_REFP) XT12000.1
NetIC12000_7: IC12000.7(VE1) R12001.1
NetIC12000_10: IC12000.10(VE2) R12000.1
NetIC12001_1: IC12001.1(SI_MODE0) R12004.2
NetIC12001_6: IC12001.6(REF_SEL) R12005.1
NetIC12001_47: IC12001.47(SI_MODE1) R12003.2

Not connected (* = marked no-connect by the designer): IC12001 8(PRI_REFP)* 9(PRI_REFN)* 14(Y0_P)* 15(Y0_N)* 20(Y2_P)* 21(Y2_N)* 22(Y3_N)* 23(Y3_P)* 25(Y4_N)* 26(Y4_P)* 28(Y5_N)* 29(Y5_P)* 32(Y6_P)* 33(Y6_N)* 35(Y7_P)* 36(Y7_N)*; IC12002 7(NIC)* 10(NIC)*

### Layout directives
rule Width Constraint [Pref Impedance = 50.00ohms    Min Impedance = 50.00ohms    Max Impedance = 50.00ohms]; rule Maximum Via Count Constraint [Max Count = 0]: (no net found under the mark)
net class CLK_OUT; rule Differential Pairs Routing [Pref Gap = 5mil    Min Gap  = 5mil    Max Gap  = 5milPref Width = 4.138mil    Min Width  = 2.925mil    Max Width  = 4.138mil]; rule Maximum Via Count Constraint [Max Count = 2]; rule Matched Net Lengths [Tolerance = 25mil]: CLK_OUT_N, CLK_OUT_P
differential pair: CLK_OUT_N, CLK_OUT_P

### Notes on the sheet
- SI_MODE[1:0] = 00: SPI Mode
  SI_MODE[1:0] = 01: I2C Mode
  SI_MODE[1:0] = 10: Pin Mode
  SI_MODE[1:0] = 11: RESERVED
- Probably replaceable with: CBR06C409BAGAC
- Project:
- Title:
- Size:
- Date:
- File:
- A2
- Project ID:
- Time:
- Sheet
- Version:
- of
- Variant:
- (in symbol IC_ADUM141E0BRWZ-RL) ISOLATION
- (in symbol IC_ADUM152N0BRZ) ISOLATION

### Library data of the parts
C12000-C12016 C12020-C12031 C12034-C12039 = C_GENERIC: Prometheus_ID: *; Prometheus_Manufacturer: *
  C12000 C12001 C12003 C12006 C12009 C12011-C12013 C12015 C12021 C12022 C12024 C12025 C12027 C12029 C12031 C12035 C12037 C12039: Prometheus_ManPartNo: 100nF; Prometheus_Comment: 100nF; Prometheus_CurrentFootprint: C_0603_N [CAPC1608N IPC]
  C12002 C12007 C12010 C12016: Prometheus_ManPartNo: 100pF; Prometheus_Comment: 100pF; Prometheus_CurrentFootprint: C_0402_N [CAPC1005N IPC]
  C12004 C12014 C12020 C12023 C12026 C12028 C12030 C12034 C12036 C12038: Prometheus_ManPartNo: 1uF; Prometheus_Comment: 1uF; Prometheus_CurrentFootprint: C_0805_N [CAPC2013N IPC]
  C12005 C12008: Prometheus_ManPartNo: 2.2uF; Prometheus_Comment: 2.2uF; Prometheus_CurrentFootprint: C_0805_N [CAPC2013N IPC]
C12017 = C_GENERIC: Prometheus_ManPartNo: GRM188R60J106KE47D; Prometheus_Manufacturer: Murata Electronics; Prometheus_ID: *; Prometheus_Comment: 10uF; Prometheus_CurrentFootprint: C_0805_N [CAPC2013N IPC]
C12018 = C_GENERIC: Prometheus_Manufacturer: Yageo; Prometheus_ID: CC0603JRNPO9BN111; Prometheus_ManPartNo: 110pF; Prometheus_Comment: 110pF; Prometheus_CurrentFootprint: C_0603_N [CAPC1608N IPC]
C12019 = C_GENERIC: Prometheus_Manufacturer: Yageo; Prometheus_ID: CC0603KRX7R9BB223; Prometheus_ManPartNo: 22nF; Prometheus_Comment: 22nF; Prometheus_CurrentFootprint: C_0603_N [CAPC1608N IPC]
C12032 C12033 = C_GENERIC: +- 0.05 pF; Prometheus_ManPartNo: CBR06C409A1GAC; Prometheus_Manufacturer: KEMET; Prometheus_ID: *; Prometheus_Comment: 4pF; Prometheus_CurrentFootprint: C_0603_N [CAPC1608N IPC]
IC12000 = IC_ADUM141E0BRWZ-RL: 3/1 digital isolator / 1.8 V to 5 V Level translation; Prometheus_Manufacturer: Analog Devices; Prometheus_ManPartNo: ADUM141E0BRWZ-RL; Prometheus_Comment: ADUM141E0BRWZ-RL; Prometheus_CurrentFootprint: SOIC127P1030X265-16N IPC; DatasheetURL: https://www.analog.com/media/en/technical-documentation/data-sheets/ADuM140D_140E_141D_141E_142D_142E.pdf
IC12001 = IC_CDCM6208V2: 2:8 Clock Generator, Jitter Cleaner with fractional dividers; Prometheus_Manufacturer: Texas Instruments; Prometheus_ManPartNo: CDCM6208V2RGZR; Prometheus_Comment: CDCM6208V2RGZR; Prometheus_CurrentFootprint: QFN50P700X700X100_HS-49N IPC; DatasheetURL: https://www.ti.com/general/docs/suppproductinfo.tsp?distId=10&gotoUrl=http%3A%2F%2Fwww.ti.com%2Flit%2Fgpn%2Fcdcm6208
IC12002 = IC_ADUM152N0BRZ: 3/2 digital isolator / 1.8 V to 5 V Level translation; Prometheus_Manufacturer: Analog Devices; Prometheus_ManPartNo: ADUM152N0BRZ; Prometheus_Comment: ADUM152N0BRZ; Prometheus_CurrentFootprint: SOIC127P600X175-16N IPC; DatasheetURL: https://www.analog.com/media/en/technical-documentation/data-sheets/ADuM150N-151N-152N.pdf
L12000 L12001 = FB_GENERIC: Prometheus_Manufacturer: Wuerth Electronics; Prometheus_ID: *; Prometheus_ManPartNo: 742792662; Prometheus_Comment: 742792662; Prometheus_CurrentFootprint: L_0603_N [INDC1608N IPC]
R12000 R12001 R12003-R12005 = R_GENERIC_DIN: Prometheus_ID: *; Prometheus_ManPartNo: 10K; Prometheus_Manufacturer: *; Prometheus_Comment: 10K; Prometheus_CurrentFootprint: R_0603_N [RESC1608N IPC]
R12002 = R_GENERIC_DIN: Prometheus_ManPartNo: ERJ-3EKF3300V; Prometheus_Manufacturer: Panasonic Electronic Components; Prometheus_ID: *; Prometheus_Comment: 330R; Prometheus_CurrentFootprint: R_0603_N [RESC1608N IPC]
TP12000-TP12008 = TP_GENERIC: Needle Test Point; Prometheus_ID: *; Prometheus_ManPartNo: TP_GENERIC; Prometheus_Manufacturer: *; Prometheus_Comment: TP_GENERIC; Prometheus_CurrentFootprint: TP_0.8_P100T
XT12000 = XT_NX3225GA-25.000M-STD-CRG-2: 25 MHz / 8 pF; Prometheus_Manufacturer: NDK; Prometheus_ID: *; Prometheus_ManPartNo: NX3225GA-25.000M-STD-CRG-2; Prometheus_Comment: NX3225GA-25.000M-STD-CRG-2; Prometheus_CurrentFootprint: XT_SMD_320x250_H100_4PIN; DatasheetURL: https://www.ndk.com/images/products/catalog/c_NX3225GA-STD-CRG-2_e.pdf

## Sheet TemperatureSensor.SchDoc: Temperature Sensor
size A4; DrawnBy: Patrik Staudenmayer; DocumentNumber: 8; SheetNumber: 8; SheetTotal: 15
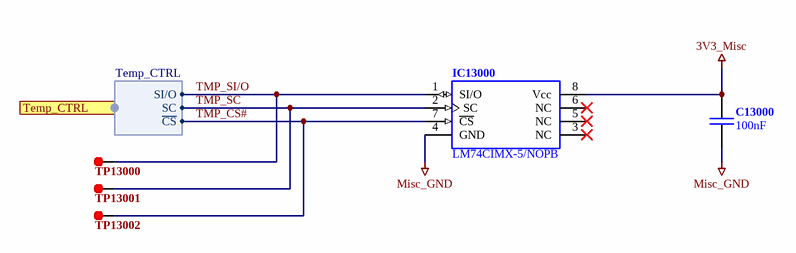
[diagram p18: TemperatureSensor.SchDoc]

### Parts
C13000  100nF  [C_0603_N [CAPC1608N IPC]]
IC13000  LM74CIMX-5/NOPB  [SOIC127P600X175-8N IPC]
TP13000  TP_GENERIC  [TP_0.8_P100T]  (value not drawn)  (no BOM)
TP13001  TP_GENERIC  [TP_0.8_P100T]  (value not drawn)  (no BOM)
TP13002  TP_GENERIC  [TP_0.8_P100T]  (value not drawn)  (no BOM)

### Ports
Temp_CTRL (in, harness Temp_CTRL)

### Harnesses
Temp_CTRL: SI/O, SC, ~{CS}

### Nets
3V3_Misc: C13000.1 IC13000.8(Vcc)
Misc_GND: C13000.2 IC13000.4(GND)  [project net Con_GND]
TMP_CS#: IC13000.7(~{CS}) TP13002.1 ; port Temp_CTRL.~{CS}
TMP_SC: IC13000.2(SC) TP13001.1 ; port Temp_CTRL.SC
TMP_SI/O: IC13000.1(SI/O) TP13000.1 ; port Temp_CTRL.SI/O

Not connected (* = marked no-connect by the designer): IC13000 3(NC)* 5(NC)* 6(NC)*

### Notes on the sheet
- Project:
- Title:
- Size:
- Date:
- A4
- Project ID:
- Time:
- Sheet
- Version:
- of
- Variant:
- File:

### Library data of the parts
C13000 = C_GENERIC: Prometheus_ID: *; Prometheus_ManPartNo: 100nF; Prometheus_Manufacturer: *; Prometheus_Comment: 100nF; Prometheus_CurrentFootprint: C_0603_N [CAPC1608N IPC]
IC13000 = IC_LM74CIMX-5/NOPB: SPI 12-Bit Plus Sign Temperature Sensor / 0.0625°C Temperature Resolution; Prometheus_Manufacturer: Texas Instruments; Prometheus_ManPartNo: LM74CIMX-5/NOPB; Prometheus_Comment: LM74CIMX-5/NOPB; Prometheus_CurrentFootprint: SOIC127P600X175-8N IPC; DatasheetURL: https://www.ti.com/lit/ds/symlink/lm74.pdf
TP13000-TP13002 = TP_GENERIC: Needle Test Point; Prometheus_ID: *; Prometheus_ManPartNo: TP_GENERIC; Prometheus_Manufacturer: *; Prometheus_Comment: TP_GENERIC; Prometheus_CurrentFootprint: TP_0.8_P100T

## Nets that join several sheets
1V8_ADC: PowerSupply (15 pins), ADC (10 pins), ClockGenerator (9 pins)
1V8_Con: PicoZed (13 pins), PowerSupply (15 pins), SD_Card (C400.1 IC400.5 R401.2), UART_JTAG (R500.2 R503.2 T500.G T501.G)
3V3_Misc: PicoZed (28 pins), PowerSupply (19 pins), USB_Ethernet (X300.20 X300.22), SD_Card (6 pins), UART_JTAG (6 pins), ProgrammableGainAmplifier (C803.1 IC801.1), ProgrammableAttenuator (5 pins), ADC (C11005.2 C11018.2 IC11001.1 IC11002.1), ClockGenerator (5 pins), TemperatureSensor (C13000.1 IC13000.8)
5V_Amp: PowerSupply (16 pins), ProgrammableGainAmplifier (C804.1 IC801.8 R801.2), Overview/HF Front End/Programmable Gain Amplifier/ASTG1 (C900_ASTG1.1 C901_ASTG1.1 L900_ASTG1.2), Overview/HF Front End/Programmable Gain Amplifier/ASTG2 (C900_ASTG2.1 C901_ASTG2.1 L900_ASTG2.2), Overview/HF Front End/Programmable Gain Amplifier/ASTG3 (C900_ASTG3.1 C901_ASTG3.1 L900_ASTG3.2), ProgrammableAttenuator (10 pins)
5V_Zed: PicoZed (24 pins), PowerSupply (21 pins)
ADC_GND: PowerSupply (14 pins), ADC (28 pins), ClockGenerator (46 pins)
AmpGND: PowerSupply (15 pins), HF_FrontEndOverview (D600.2 X600.2), LowPassFilter (5 pins), ProgrammableGainAmplifier (5 pins), Overview/HF Front End/Programmable Gain Amplifier/ASTG1 (5 pins), Overview/HF Front End/Programmable Gain Amplifier/ASTG2 (5 pins), Overview/HF Front End/Programmable Gain Amplifier/ASTG3 (5 pins), ProgrammableAttenuator (22 pins), ADC (5 pins)
Con_GND: PicoZed (118 pins), PowerSupply (69 pins), USB_Ethernet (16 pins), SD_Card (9 pins), UART_JTAG (7 pins), ProgrammableGainAmplifier (C803.2 IC801.4), ProgrammableAttenuator (7 pins), ADC (5 pins), ClockGenerator (5 pins), TemperatureSensor (C13000.2 IC13000.4)
USB_VBUS: PicoZed (X102.68), PowerSupply (16 pins), USB_Ethernet (5 pins)
ADC_OE: PicoZed (TP143.1 X100.83), ADC (IC11002.3 TP11005.1)
ADC_RESET: PicoZed (TP141.1 X100.75), ADC (IC11001.6 TP11003.1)
ADC_SCLK: PicoZed (TP139.1 X100.73), ADC (IC11001.5 TP11002.1)
ADC_SDATA: PicoZed (TP137.1 X100.69), ADC (IC11001.4 TP11001.1)
ADC_SDOUT: PicoZed (TP142.1 X100.81), ADC (IC11002.2 TP11004.1)
ADC_SEN: PicoZed (TP135.1 X100.67), ADC (IC11001.3 TP11000.1)
AmpIN: Overview/HF Front End/Programmable Gain Amplifier/ASTG1 (C904_ASTG1.2), Overview/HF Front End/Programmable Gain Amplifier/ASTG2 (C904_ASTG2.2), Overview/HF Front End/Programmable Gain Amplifier/ASTG3 (C904_ASTG3.2)
AmpOUT: Overview/HF Front End/Programmable Gain Amplifier/ASTG1 (C905_ASTG1.1), Overview/HF Front End/Programmable Gain Amplifier/ASTG2 (C905_ASTG2.1), Overview/HF Front End/Programmable Gain Amplifier/ASTG3 (C905_ASTG3.1)
CLK_MISO: PicoZed (TP127.1 X100.44), ClockGenerator (IC12000.6)
CLK_MOSI: PicoZed (TP121.1 X100.36), ClockGenerator (IC12000.3)
CLK_PD#: PicoZed (TP131.1 X100.50), ClockGenerator (IC12002.3)
CLK_RESET#/PWR: PicoZed (TP129.1 X100.48), ClockGenerator (IC12002.2)
CLK_SCL: PicoZed (TP125.1 X100.42), ClockGenerator (IC12000.5)
CLK_SCS: PicoZed (TP123.1 X100.38), ClockGenerator (IC12000.4)
CLK_STATUS0: PicoZed (TP133.1 X100.56), ClockGenerator (IC12002.5)
CLK_STATUS1: PicoZed (TP134.1 X100.62), ClockGenerator (IC12002.6)
CLK_SYNC#: PicoZed (TP132.1 X100.54), ClockGenerator (IC12002.4)
IN12: PowerSupply (IC201.1 IC201.2), USB_Ethernet (TR300.1)
IN36: PowerSupply (IC201.3 IC201.4), USB_Ethernet (TR300.4)
IN45: PowerSupply (IC201.5 IC201.6), USB_Ethernet (TR300.7)
IN78: PowerSupply (IC201.7 IC201.8), USB_Ethernet (TR300.10)
JTAG_RST#: PicoZed (IC100.3 TP147.1), UART_JTAG (R511.1 X501.1)
JTAG_TCK: PicoZed (TP101.1 X100.1), UART_JTAG (R510.2 X501.9)
JTAG_TDI: PicoZed (X100.4), UART_JTAG (R510.4 X501.5)
JTAG_TDO: PicoZed (TP102.1 X100.3), UART_JTAG (JP500.2 X501.7)
JTAG_TMS: PicoZed (TP100.1 X100.2), UART_JTAG (R510.1 X501.11)
PGA_EN_A: PicoZed (TP128.1 X100.47), ProgrammableGainAmplifier (IC801.2 TP810.1)
PGA_EN_B: PicoZed (TP130.1 X100.49), ProgrammableGainAmplifier (IC801.3 TP809.1)
T2P#: PicoZed (TP116.1 X100.30), PowerSupply (IC201.10 R205.1)
TMP_CS#: PicoZed (TP140.1 X100.74), TemperatureSensor (IC13000.7 TP13002.1)
TMP_SC: PicoZed (TP138.1 X100.70), TemperatureSensor (IC13000.2 TP13001.1)
TMP_SI/O: PicoZed (TP136.1 X100.68), TemperatureSensor (IC13000.1 TP13000.1)
UART_RXD: PicoZed (TP155.1 X102.42), UART_JTAG (R500.1 T500.S TP500.1)
UART_TXD: PicoZed (TP156.1 X102.44), UART_JTAG (R503.1 T501.S TP501.1)

## Assembly variants
FULL: all parts fitted